# Altium schematic sheet AMC_SFP.SchDoc
size A3
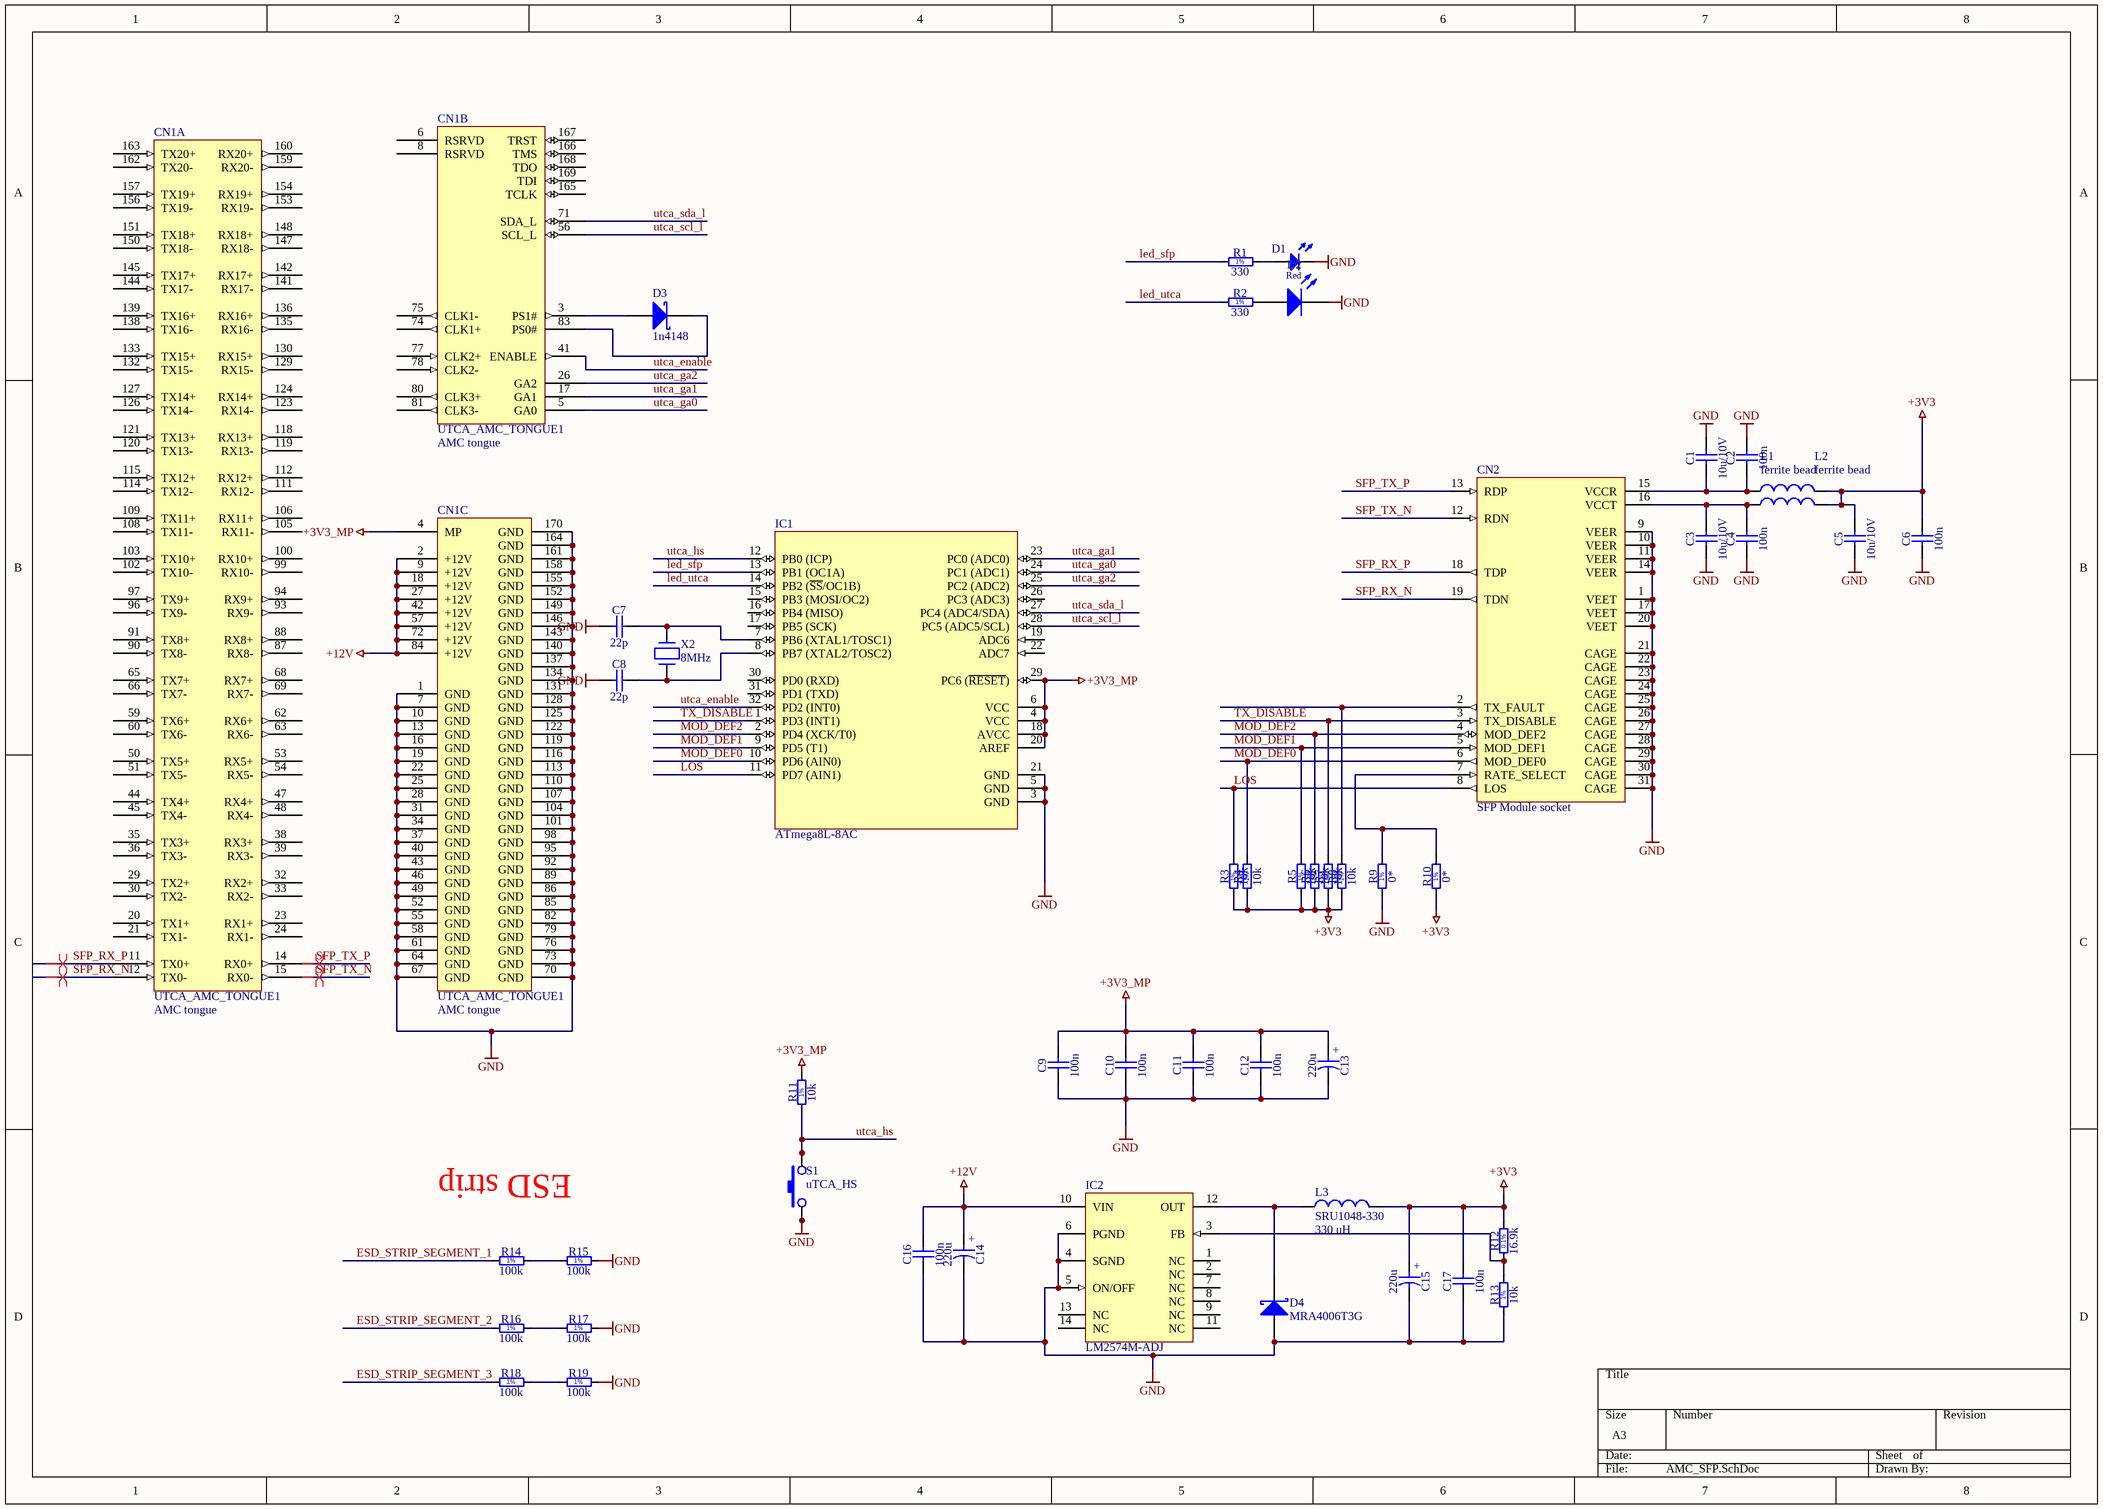
[diagram p0: AMC_SFP.SchDoc]

## Parts
C1  10u/10V  [CAPC3216X140N]
C2  100n  [CAPC1608X87N]
C3  10u/10V  [CAPC3216X140N]
C4  100n  [CAPC1608X87N]
C5  10u/10V  [CAPC3216X140N]
C6  100n  [CAPC1608X87N]
C7  22p  [CAPC2012X135N]
C8  22p  [CAPC2012X135N]
C9  100n  [CAPC2012X135N]
C10  100n  [CAPC2012X135N]
C11  100n  [CAPC2012X135N]
C12  100n  [CAPC2012X135N]
C13  220u  [CAPPR350-850X600]
C14  220u  [CAPPR350-850X600]
C15  220u  [CAPPR350-850X600]
C16  100n  [CAPC1608X87N]
C17  100n  [CAPC1608X87N]
CN1  UTCA_AMC_TONGUE1  value AMC tongue  [UTCA_AMC_TONGUE]  (parts A,B,C of 3)
CN2  SFP Module socket  [SFP_SINGLE_PORT]
D1  Green  [LED_3MM_RED_1C-2A]  (value not drawn)
D2  LED  [CD1608-0603]  (value not drawn)
D3  1n4148  [CD2012-0805]
D4  MRA4006T3G  [SMB]
IC1  ATmega8L-8AC  [32A_N]
IC2  LM2574M-ADJ  [M14B_N]
L1  value ferrite bead  [INDC2012-0805]  (hidden comment: Inductor)
L2  value ferrite bead  [INDC2012-0805]  (hidden comment: Inductor)
L3  SRU1048-330  value 330 uH  [L_BOURNS_SRU1048]
R1  330  [RESC2012X60N]
R2  330  [RESC2012X60N]
R3  10k  [RESC1608X55N]
R4  10k  [RESC1608X55N]
R5  10k  [RESC1608X55N]
R6  10k  [RESC1608X55N]
R7  10k  [RESC1608X55N]
R8  10k  [RESC1608X55N]
R9  0*  [RESC1608X55N]
R10  0*  [RESC1608X55N]
R11  10k  [RESC1608X55N]
R12  16.9k  [RESC2012X60N]
R13  10k  [RESC2012X60N]
R14  100k  [RESC3216X65N]
R15  100k  [RESC3216X65N]
R16  100k  [RESC3216X65N]
R17  100k  [RESC3216X65N]
R18  100k  [RESC3216X65N]
R19  100k  [RESC3216X65N]
S1  uTCA_HS  [uTCA_HOTSWAP_SWITCH]
X2  8MHz  [HC-49US]

## Nets
+3V3: C5.2 C6.2 C15.1 C17.2 L1.2 L2.2 L3.2 R3.1 R4.1 R5.1 R6.1 R7.1 R8.1 R10.1 R12.2
+3V3_MP: C9.2 C10.2 C11.2 C12.2 C13.1 CN1.4(MP) IC1.4(VCC) IC1.6(VCC) IC1.18(AVCC) IC1.20(AREF) IC1.29(PC6_(~{RESET})) R11.2
+12V: C14.1 C16.2 CN1.2(+12V) CN1.9(+12V) CN1.18(+12V) CN1.27(+12V) CN1.42(+12V) CN1.57(+12V) CN1.72(+12V) CN1.84(+12V) IC2.10(VIN)
GND: C1.2 C2.2 C3.1 C4.1 C5.1 C6.1 C7.1 C8.1 C9.1 C10.1 C11.1 C12.1 C13.2 C14.2 C15.2 C16.1 C17.1 CN1.1(GND) CN1.7(GND) CN1.10(GND) CN1.13(GND) CN1.16(GND) CN1.19(GND) CN1.22(GND) CN1.25(GND) CN1.28(GND) CN1.31(GND) CN1.34(GND) CN1.37(GND) CN1.40(GND) CN1.43(GND) CN1.46(GND) CN1.49(GND) CN1.52(GND) CN1.55(GND) CN1.58(GND) CN1.61(GND) CN1.64(GND) CN1.67(GND) CN1.70(GND) CN1.73(GND) CN1.76(GND) CN1.79(GND) CN1.82(GND) CN1.85(GND) CN1.86(GND) CN1.89(GND) CN1.92(GND) CN1.95(GND) CN1.98(GND) CN1.101(GND) CN1.104(GND) CN1.107(GND) CN1.110(GND) CN1.113(GND) CN1.116(GND) CN1.119(RX13-) CN1.122(GND) CN1.125(GND) CN1.128(GND) CN1.131(GND) CN1.134(GND) CN1.137(GND) CN1.140(GND) CN1.143(GND) CN1.146(GND) CN1.149(GND) CN1.152(GND) CN1.155(GND) CN1.158(GND) CN1.161(GND) CN1.164(GND) CN1.170(GND) CN2.1(VEET) CN2.9(VEER) CN2.10(VEER) CN2.11(VEER) CN2.14(VEER) CN2.17(VEET) CN2.20(VEET) CN2.21(CAGE) CN2.22(CAGE) CN2.23(CAGE) CN2.24(CAGE) CN2.25(CAGE) CN2.26(CAGE) CN2.27(CAGE) CN2.28(CAGE) CN2.29(CAGE) CN2.30(CAGE) CN2.31(CAGE) D1.1(C) D2.2(K) D4.1(A) IC1.3(GND) IC1.5(GND) IC1.21(GND) IC2.4(SGND) IC2.5(ON/OFF) IC2.6(PGND) R9.1 R13.1 R15.2 R17.2 R19.2 S1.A S1.C
ESD_STRIP_SEGMENT_1: R14.1
ESD_STRIP_SEGMENT_2: R16.1
ESD_STRIP_SEGMENT_3: R18.1
led_sfp: IC1.13(PB1_(OC1A)) R1.1
led_utca: IC1.14(PB2_(~{SS}/OC1B)) R2.1
LOS: CN2.8(LOS) IC1.11(PD7_(AIN1)) R3.2
MOD_DEF0: CN2.6(MOD_DEF0) IC1.10(PD6_(AIN0)) R4.2
MOD_DEF1: CN2.5(MOD_DEF1) IC1.9(PD5_(T1)) R5.2
MOD_DEF2: CN2.4(MOD_DEF2) IC1.2(PD4_(XCK/T0)) R6.2
SFP_RX_N: CN1.12(TX0-) CN2.19(TDN)
SFP_RX_P: CN1.11(TX0+) CN2.18(TDP)
SFP_TX_N: CN1.15(RX0-) CN2.12(RDN)
SFP_TX_P: CN1.14(RX0+) CN2.13(RDP)
TX_DISABLE: CN2.3(TX_DISABLE) IC1.1(PD3_(INT1)) R7.2
utca_enable: CN1.41(ENABLE) IC1.32(PD2_(INT0))
utca_ga0: CN1.5(GA0) IC1.24(PC1_(ADC1))
utca_ga1: CN1.17(GA1) IC1.23(PC0_(ADC0))
utca_ga2: CN1.26(GA2) IC1.25(PC2_(ADC2))
utca_hs: IC1.12(PB0_(ICP)) R11.1 S1.B S1.D
utca_scl_l: CN1.56(SCL_L) IC1.28(PC5_(ADC5/SCL))
utca_sda_l: CN1.71(SDA_L) IC1.27(PC4_(ADC4/SDA))
NetC1_1: C1.1 C2.1 CN2.15(VCCR) L2.1
NetC3_2: C3.2 C4.2 CN2.16(VCCT) L1.1
NetC7_2: C7.2 IC1.7(PB6_(XTAL1/TOSC1)) X2.2
NetC8_2: C8.2 IC1.8(PB7_(XTAL2/TOSC2)) X2.1
NetCN1_3: CN1.3(PS1#) D3.1(A)
NetCN1_83: CN1.83(PS0#) D3.2(K)
NetCN2_2: CN2.2(TX_FAULT) R8.2
NetCN2_7: CN2.7(RATE_SELECT) R9.2 R10.2
NetD1_2: D1.2(A) R1.2
NetD2_1: D2.1(A) R2.2
NetD4_2: D4.2(K) IC2.12(OUT) L3.1
NetIC2_3: IC2.3(FB) R12.1 R13.2
NetR14_2: R14.2 R15.1
NetR16_2: R16.2 R17.1
NetR18_2: R18.2 R19.1

Not connected (* = marked no-connect by the designer): CN1 6(RSRVD) 8(RSRVD) 20(TX1+) 21(TX1-) 23(RX1+) 24(RX1-) 29(TX2+) 30(TX2-) 32(RX2+) 33(RX2-) 35(TX3+) 36(TX3-) 38(RX3+) 39(RX3-) 44(TX4+) 45(TX4-) 47(RX4+) 48(RX4-) 50(TX5+) 51(TX5-) 53(RX5+) 54(RX5-) 59(TX6+) 60(TX6-) 62(RX6+) 63(RX6-) 65(TX7+) 66(TX7-) 68(RX7+) 69(RX7-) 74(CLK1+) 75(CLK1-) 77(CLK2+) 78(CLK2-) 80(CLK3+) 81(CLK3-) 87(RX8-) 88(RX8+) 90(TX8-) 91(TX8+) 93(RX9-) 94(RX9+) 96(TX9-) 97(TX9+) 99(RX10-) 100(RX10+) 102(TX10-) 103(TX10+) 105(RX11-) 106(RX11+) 108(TX11-) 109(TX11+) 111(RX12-) 112(RX12+) 114(TX12-) 115(TX12+) 118(RX13+) 120(TX13-) 121(TX13+) 123(RX14-) 124(RX14+) 126(TX14-) 127(TX14+) 129(RX15-) 130(RX15+) 132(TX15-) 133(TX15+) 135(RX16-) 136(RX16+) 138(TX16-) 139(TX16+) 141(RX17-) 142(RX17+) 144(TX17-) 145(TX17+) 147(RX18-) 148(RX18+) 150(TX18-) 151(TX18+) 153(RX19-) 154(RX19+) 156(TX19-) 157(TX19+) 159(RX20-) 160(RX20+) 162(TX20-) 163(TX20+) 165(TCLK) 166(TMS) 167(TRST) 168(TDO) 169(TDI); IC1 15(PB3_(MOSI/OC2)) 16(PB4_(MISO)) 17(PB5_(SCK)) 19(ADC6) 22(ADC7) 26(PC3_(ADC3)) 30(PD0_(RXD)) 31(PD1_(TXD)); IC2 1(NC) 2(NC) 7(NC) 8(NC) 9(NC) 11(NC) 13(NC) 14(NC)

## Layout directives
differential pair: SFP_RX_N, SFP_RX_P, SFP_TX_N, SFP_TX_P

## Notes on the sheet
- ESD strip
- (in symbol CAER_100UF_10V_20%_350-850X600_LESR0R032) +
- (in symbol R0603_0R_JUMPER) 1%
- (in symbol R0603_10K_1%_0.1W_100PPM) 1%
- (in symbol R0805_10K_1%_0.125W_100PPM) 1%
- (in symbol R0805_16K9_0.1%_0.1W_10PPM) 0.1%
- (in symbol R0805_330R_1%_0.125W_100PPM) 1%
- (in symbol R1206_100K_1%_0.25W_100PPM) 1%

## Library data of the parts
C1 C3 C5 = CC1206_10UF_10V_10%_X7R: Non-polarised capacitor; Part Description: SMD Multilayer Chip Ceramic Capacitor; Manufacturer: GENERIC; Manufacturer1 Part Number: C1206C106K8RAC; Manufacturer1 Datasheet: \\cern.ch\dfs\Applications\Altium\Datasheets\CC1206_X7R_KEMET.pdf; Value: 10uF; Voltage: 10V; TC: X7R; Tolerance: ±10%; Table: Capacitors SMD; Part Number: CC1206_10UF_10V_10%_X7R; Component Kind: Standard; Component Type: Standard; Designator: Capacitor - non polarized; Library Reference: Capacitor - non polarized; Pin Count: 2; Status: Preferred; Manufacturer Part Number: CC1206_10uF_10V_10%_X7R; Case: 1206; Mounted: Yes; Socket: No; SMD: Yes; Manufacturer1 Example: KEMET; Manufacturer1 ComponentHeight: 1.8mm; HelpURL: \\cern.ch\dfs\Applications\Altium\Datasheets\CC1206_X7R_KEMET.pdf; Author: CERN DEM JLC; CreateDate: 12/3/2007; LatestRevisionDate: 12/3/2007
C2 C4 C6 C16 C17 = CC0603_100NF_50V_10%_X7R: Non-polarised capacitor; Part Description: SMD Multilayer Chip Ceramic Capacitor; Manufacturer: GENERIC; Manufacturer1 Part Number: 223858615649; Manufacturer1 Datasheet: \\cern.ch\dfs\Applications\Altium\Datasheets\CC0603_X7R_PHYCOMP.pdf; Value: 100nF; Voltage: 50V; TC: X7R; Tolerance: ±10%; Table: Capacitors SMD; Part Number: CC0603_100NF_50V_10%_X7R; Component Kind: Standard; Component Type: Standard; Designator: Capacitor - non polarized; Library Reference: Capacitor - non polarized; Pin Count: 2; Status: Preferred; Manufacturer Part Number: CC0603_100NF_50V_10%_X7R; Case: 0603; Mounted: Yes; Socket: No; SMD: Yes; Manufacturer1 Example: PHYCOMP; Manufacturer1 ComponentHeight: 0.87mm; HelpURL: \\cern.ch\dfs\Applications\Altium\Datasheets\CC0603_X7R_PHYCOMP.pdf; Author: CERN DEM JLC; CreateDate: 12/3/2007; LatestRevisionDate: 12/3/2007
C7 C8 = CC0805_22PF_50V_5%_NP0: Non-polarised capacitor; Part Description: SMD Multilayer Chip Ceramic Capacitor; Manufacturer: GENERIC; Manufacturer1 Part Number: 223886115229; Manufacturer1 Datasheet: \\cern.ch\dfs\Applications\Altium\Datasheets\CC0805_NP0_PHYCOMP.pdf; Value: 22pF; Voltage: 50V; TC: NP0; Tolerance: ±5%; Table: Capacitors SMD; Part Number: CC0805_22PF_50V_5%_NP0; Component Kind: Standard; Component Type: Standard; Designator: Capacitor - non polarized; Library Reference: Capacitor - non polarized; Pin Count: 2; Status: Preferred; Manufacturer Part Number: CC0805_22PF_50V_5%_NP0; Case: 0805; Mounted: Yes; Socket: No; SMD: Yes; Manufacturer1 Example: PHYCOMP; Manufacturer1 ComponentHeight: 1.35mm; HelpURL: \\cern.ch\dfs\Applications\Altium\Datasheets\CC0805_NP0_PHYCOMP.pdf; Author: CERN DEM JLC; CreateDate: 12/3/2007; LatestRevisionDate: 12/3/2007
C9-C12 = CC0805_100NF_50V_10%_X7R: Non-polarised capacitor; Part Description: SMD Multilayer Chip Ceramic Capacitor; Manufacturer: GENERIC; Manufacturer1 Part Number: B37941K5104K62; Manufacturer1 Datasheet: \\cern.ch\dfs\Applications\Altium\Datasheets\CC0805_X7R_EPCOS.pdf; Value: 100nF; Voltage: 50V; TC: X7R; Tolerance: ±10%; Table: Capacitors SMD; Part Number: CC0805_100NF_50V_10%_X7R; Component Kind: Standard; Component Type: Standard; Designator: Capacitor - non polarized; Library Reference: Capacitor - non polarized; Pin Count: 2; Status: Preferred; Manufacturer Part Number: CC0805_100NF_50V_10%_X7R; Case: 0805; Mounted: Yes; Socket: No; SMD: Yes; Manufacturer1 Example: EPCOS; Manufacturer1 ComponentHeight: 1.35mm; HelpURL: \\cern.ch\dfs\Applications\Altium\Datasheets\CC0805_X7R_EPCOS.pdf; Author: CERN DEM JLC; CreateDate: 12/3/2007; LatestRevisionDate: 12/3/2007
C13-C15 = CAER_100UF_10V_20%_350-850X600_LESR0R032: Polarised capacitor; Part Description: Low ESR 0R032 Aluminum Solid Capacitor With Organic Semiconductive Electrolyte; Manufacturer: SANYO; Manufacturer Part Number: 10SP100M; Value: 100uF; Voltage: 10V; Tolerance: ±20%; Table: Capacitors THD; Part Number: CAER_100UF_10V_20%_350-850X600_LESR0R032; Component Kind: Standard; Component Type: Standard; Designator: Capacitor - polarized; Library Reference: Capacitor - polarized; Pin Count: 2; Status: Preferred; Case: LS3.5 D8.5 x H6; Mounted: Yes; Socket: No; SMD: No; ComponentHeight: 6mm; Datasheet: \\cern.ch\dfs\Applications\Altium\Datasheets\CAER-LESR_SANYO_SP.pdf; HelpURL: \\cern.ch\dfs\Applications\Altium\Datasheets\CAER-LESR_SANYO_SP.pdf; Author: CERN DEM JLC; CreateDate: 1/29/2008; LatestRevisionDate: 3/16/2009
CN1 = UTCA_AMC_TONGUE1: AMC1.0 connector
CN2 = SFP_SOCKET_SINGLE: Socket for SFP module
D1 = LED_AVAGO_HLMP-1700: LED Red 1C 2A; Part Description: 3mm Red LED; Manufacturer: AVAGO TECHNOLOGIES; Table: LEDs & Displays; Part Number: LED_AVAGO_HLMP-1700; Component Kind: Standard; Component Type: Standard; Designator: LED Red 1C 2A; Color: Red; Device: HLMP-1700; Library Reference: LED Red 1C 2A; PackageDescription: LED, Red, Body Dia. 3.43 mm, Pin spacing 2.54mm; Manufacturer Part Number: HLMP-1700; Pin Count: 2; Mounted: Yes; Socket: No; SMD: No; ComponentHeight: 6.35mm(min); Datasheet: \\cern.ch\dfs\Applications\Altium\Datasheets\LED_AVAGO_HLMP-1700.pdf; HelpURL: \\cern.ch\dfs\Applications\Altium\Datasheets\LED_AVAGO_HLMP-1700.pdf; Author: CERN DEM JLC; CreateDate: 6/12/2008; LatestRevisionDate: 6/12/2008
D2 = LED0: Chip LED (any color); Published: 8-Jun-2000; LatestRevisionDate: 08-Jul-2005; LatestRevisionNote: Mech Layer 1 removed.; PackageReference: LED-0; Publisher: Altium Limited
D3 D4 = D Schottky: Schottky Diode; Published: 8-Jun-2000; LatestRevisionDate: 17-Jul-2002; LatestRevisionNote: Re-released for DXP Platform.; PackageReference: SMB; Publisher: Altium Limited; Code_JEDEC: DO-214-AA
IC1 = ATmega8L-8AC: 8-Bit AVR Microcontroller with 8K Bytes of In-System Programmable Flash Memory; Published: 17-Sep-2003; LatestRevisionDate: 13-Apr-2006; LatestRevisionNote: IPC-7351 Footprint Added.; DatasheetVersion: 2486H-AVR-09/02; PackageVersion: revB, Oct-2001; PackageReference: 32A; Publisher: Altium Limited; PackageDescription: 32-Pin Thin Quad Flat Pack 0.8 mm Pitch; Code_JEDEC: MS-026-ABA; ComponentLink1Description: Manufacturer Link; ComponentLink1URL: http://www.atmel.com; ComponentLink2Description: Datasheet; ComponentLink2URL: http://www.atmel.com/dyn/resources/prod_documents/doc2486.pdf
IC2 = LM2574M-ADJ: SIMPLE SWITCHER 0.5A Step-Down Voltage Regulator; Manufacturer: National Semiconductor; PackageTopMarking: NSUZXYTT*LM2574M*-ADJ P+; Published: 27-Nov-2008; DatasheetVersion: Jun-1999; PackageVersion: revD, Feb-1987; PackageReference: M14B; Publisher: Altium Limited; PackageDescription: Molded Package, S.O., .300in Wide, 14 Lead; CompType: Switcher; PartNumber: LM2574M-ADJ; RoHS: O; PinCount: 14; DigiKeyPartNumber: LM2574M-ADJ-ND; Code_JEDEC: MS-013-AF; Code_IPC: SOIC127P1030-14; ComponentLink1Description: LM2574 Datasheet; ComponentLink1URL: http://www.national.com/ds/LM/LM2574.pdf; ComponentLink2Description: LM2574 Web Page; ComponentLink2URL: http://www.national.com/pf/LM/LM2574.html; ComponentLink3Description: M14B Package Page; ComponentLink3URL: http://www.national.com/packaging/folders/m14b.html
L1 L2 = Inductor: Ferrite bead; Published: 8-Jun-2000; Revision: July-2002: Re-released for DXP Platform.; Publisher: Altium Limited
L3 = Inductor: Code_IEC: 1005; Published: 8-Jun-2000; LatestRevisionDate: 17-Jul-2002; LatestRevisionNote: Re-released for DXP Platform.; PackageReference: 0402-A; Publisher: Altium Limited; Code_JEITA: 0402
R1 R2 = R0805_330R_1%_0.125W_100PPM: Resistor - 1%; Part Description: General Purpose Thick Film Chip Resistor; Manufacturer: GENERIC; Manufacturer1 Part Number: NRC10F3300TRF; Manufacturer1 Datasheet: \\cern.ch\dfs\Applications\Altium\Datasheets\R0805_NIC_NRC.pdf; Power: 0.125W; TC: ±100ppm/°C; Table: Resistors SMD; Part Number: R0805_330R_1%_0.125W_100PPM; Component Kind: Standard; Component Type: Standard; Designator: Resistor - 1%; Library Reference: Resistor - 1%; Pin Count: 2; Value: 330; Status: Preferred; Tolerance: ±1%; Manufacturer Part Number: R0805_330R_1%_0.125W_100PPM; Case: 0805; Mounted: Yes; Socket: No; SMD: Yes; Manufacturer1 Example: NIC COMPONENT; Manufacturer1 ComponentHeight: 0.6mm; HelpURL: \\cern.ch\dfs\Applications\Altium\Datasheets\R0805_NIC_NRC.pdf; Author: CERN DEM JLC; CreateDate: 12/3/2007; LatestRevisionDate: 3/13/2008
R3-R8 R11 = R0603_10K_1%_0.1W_100PPM: Resistor - 1%; Part Description: General Purpose Thick Film Chip Resistor; Manufacturer: GENERIC; Manufacturer1 Part Number: NRC06F1002TRF; Manufacturer1 Datasheet: \\cern.ch\dfs\Applications\Altium\Datasheets\R0603_NIC_NRC.pdf; Power: 0.1W; TC: ±100ppm/°C; Table: Resistors SMD; Part Number: R0603_10K_1%_0.1W_100PPM; Component Kind: Standard; Component Type: Standard; Designator: Resistor - 1%; Library Reference: Resistor - 1%; Pin Count: 2; Value: 10k; Status: Preferred; Tolerance: ±1%; Manufacturer Part Number: R0603_10K_1%_0.1W_100PPM; Case: 0603; Mounted: Yes; Socket: No; SMD: Yes; Manufacturer1 Example: NIC COMPONENT; Manufacturer1 ComponentHeight: 0.55mm; HelpURL: \\cern.ch\dfs\Applications\Altium\Datasheets\R0603_NIC_NRC.pdf; Author: CERN DEM JLC; CreateDate: 12/3/2007; LatestRevisionDate: 3/13/2008
R9 R10 = R0603_0R_JUMPER: Resistor - 1%; Part Description: 1A (0.05R Max DC Resistance) Zero Ohm Jumper; Manufacturer: GENERIC; Manufacturer1 Part Number: NRC06Z0; Manufacturer1 Datasheet: \\cern.ch\dfs\Applications\Altium\Datasheets\R0603_NIC_NRC.pdf; Value: 0; Table: Resistors SMD; Part Number: R0603_0R_JUMPER; Component Kind: Standard; Component Type: Standard; Designator: Resistor - 1%; Library Reference: Resistor - 1%; Pin Count: 2; Status: Preferred; Manufacturer Part Number: R0603_0R_JUMPER; Case: 0603; Mounted: Yes; Socket: No; SMD: Yes; Manufacturer1 Example: NIC COMPONENT; Manufacturer1 ComponentHeight: 0.55mm; HelpURL: \\cern.ch\dfs\Applications\Altium\Datasheets\R0603_NIC_NRC.pdf; Author: CERN DEM JLC; CreateDate: 12/3/2007; LatestRevisionDate: 3/13/2008
R12 = R0805_16K9_0.1%_0.1W_10PPM: Resistor - 0.1%; Part Description: Thin Film Chip Resistor; Manufacturer: GENERIC; Manufacturer1 Part Number: RN73C2A16K9BTG; Manufacturer1 Datasheet: \\cern.ch\dfs\Applications\Altium\Datasheets\R0805_Tyco_RN73.pdf; Value: 16k9; Power: 0.1W; TC: ±10ppm; Table: Resistors SMD; Part Number: R0805_16K9_0.1%_0.1W_10PPM; Component Kind: Standard; Component Type: Standard; Designator: Resistor - 0.1%; Library Reference: Resistor - 0.1%; Pin Count: 2; Status: Not recommended; Tolerance: ±0.1%; Manufacturer Part Number: R0805_16K9_0.1%_0.1W_10PPM; Case: 0805; Mounted: Yes; Socket: No; SMD: Yes; Manufacturer1 Example: TYCO HOLSWORTHY; Manufacturer1 ComponentHeight: 0.6mm; HelpURL: \\cern.ch\dfs\Applications\Altium\Datasheets\R0805_Tyco_RN73.pdf; Author: CERN DEM JLC; CreateDate: 12/3/2007; LatestRevisionDate: 3/13/2008
R13 = R0805_10K_1%_0.125W_100PPM: Resistor - 1%; Part Description: General Purpose Thick Film Chip Resistor; Manufacturer: GENERIC; Manufacturer1 Part Number: NRC10F1002TRF; Manufacturer1 Datasheet: \\cern.ch\dfs\Applications\Altium\Datasheets\R0805_NIC_NRC.pdf; Power: 0.125W; TC: ±100ppm/°C; Table: Resistors SMD; Part Number: R0805_10K_1%_0.125W_100PPM; Component Kind: Standard; Component Type: Standard; Designator: Resistor - 1%; Library Reference: Resistor - 1%; Pin Count: 2; Value: 10k; Status: Preferred; Tolerance: ±1%; Manufacturer Part Number: R0805_10K_1%_0.125W_100PPM; Case: 0805; Mounted: Yes; Socket: No; SMD: Yes; Manufacturer1 Example: NIC COMPONENT; Manufacturer1 ComponentHeight: 0.6mm; HelpURL: \\cern.ch\dfs\Applications\Altium\Datasheets\R0805_NIC_NRC.pdf; Author: CERN DEM JLC; CreateDate: 12/3/2007; LatestRevisionDate: 3/13/2008
R14-R19 = R1206_100K_1%_0.25W_100PPM: Resistor - 1%; Part Description: General Purpose Thick Film Chip Resistor; Manufacturer: GENERIC; Manufacturer1 Part Number: NRC12F1003TRF; Manufacturer1 Datasheet: \\cern.ch\dfs\Applications\Altium\Datasheets\R1206_NIC_NRC.pdf; Power: 0.25W; TC: ±100ppm/°C; Table: Resistors SMD; Part Number: R1206_100K_1%_0.25W_100PPM; Component Kind: Standard; Component Type: Standard; Designator: Resistor - 1%; Library Reference: Resistor - 1%; Pin Count: 2; Value: 100k; Status: Preferred; Tolerance: ±1%; Manufacturer Part Number: R1206_100K_1%_0.25W_100PPM; Case: 1206; Mounted: Yes; Socket: No; SMD: Yes; Manufacturer1 Example: NIC COMPONENT; Manufacturer1 ComponentHeight: 0.65mm; HelpURL: \\cern.ch\dfs\Applications\Altium\Datasheets\R1206_NIC_NRC.pdf; Author: CERN DEM JLC; CreateDate: 2007-12-03; LatestRevisionDate: 2008-03-13
S1 = uTCA_HOTSWAP_SWITCH: Push button; RefId: 20849-209; Value: uTCA hotswap switch; Supplier: Schroff
X2 = X_CRYSTAL: Crystal oscillator